# Altium schematic sheet USB_OTG_FS.SchDoc
size A4; DocumentNumber: 3; Revision: B.1(PCB.SCH); SheetNumber: 3; SheetTotal: 7
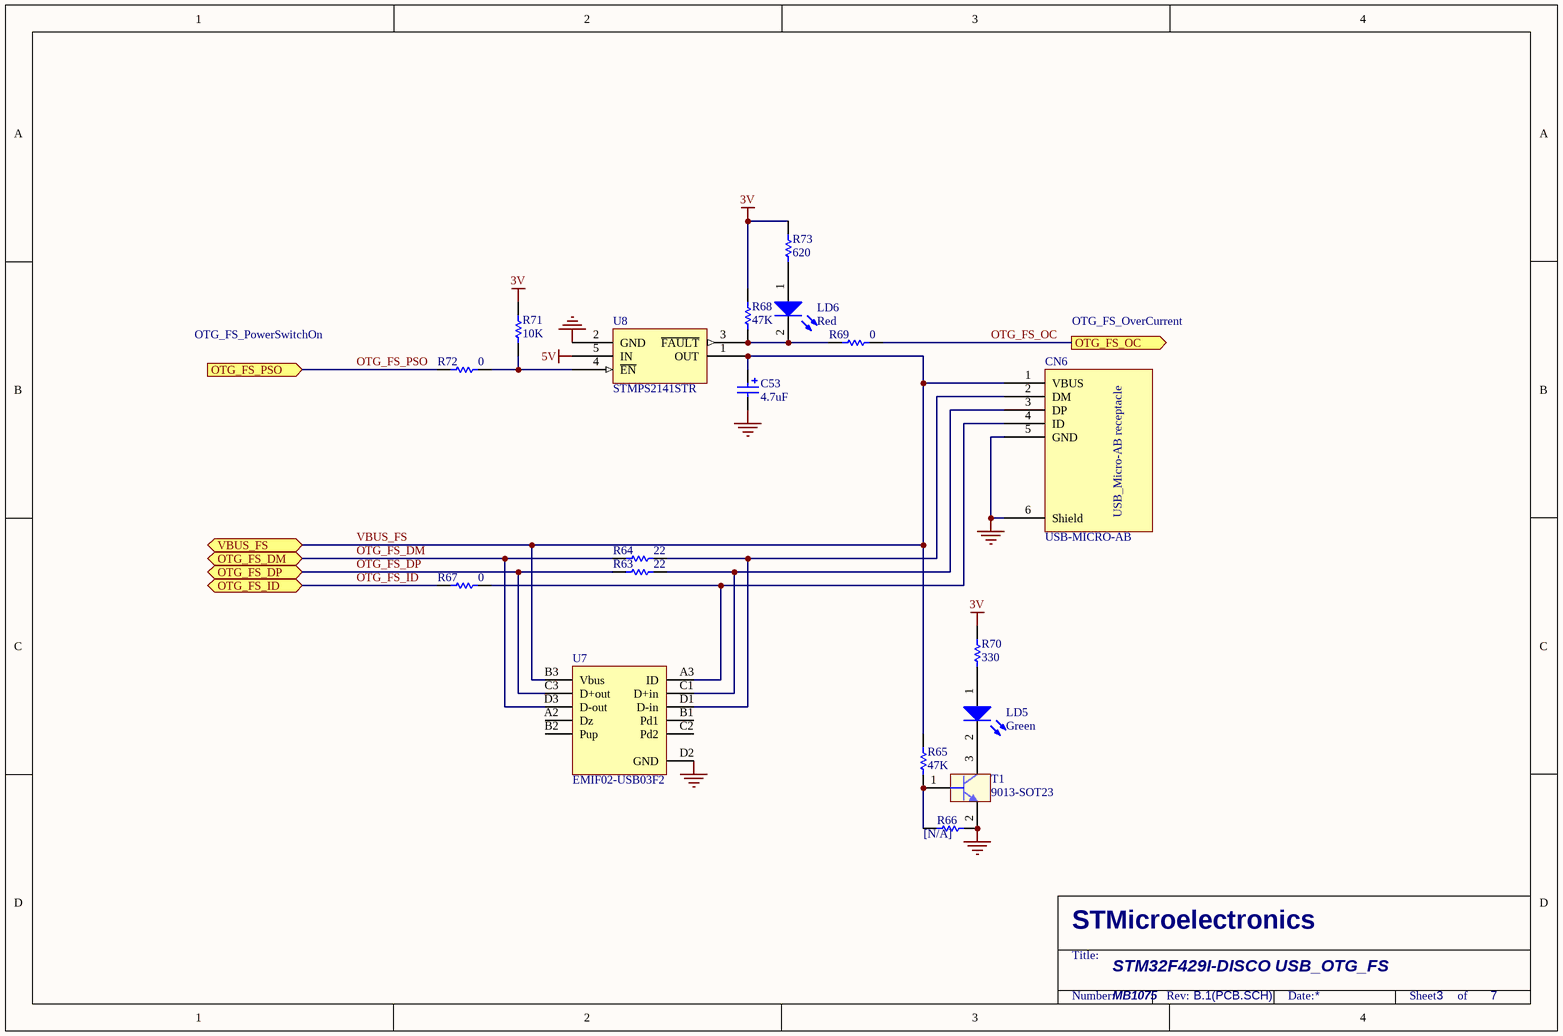
[diagram p0: USB_OTG_FS.SchDoc]

## Parts
C53  4.7uF  [TAN-A]
CN6  USB-MICRO-AB  [USB-MICRO-AB]
LD5  Green  [0603D]
LD6  Red  [0603D]
R63  22  [0402R]
R64  22  [0402R]
R65  47K  [0402R]
R66  [N/A]  [0402R]
R67  0  [0402R]
R68  47K  [0402R]
R69  0  [0402R]
R70  330  [0603R]
R71  10K  [0402R]
R72  0  [0402R]
R73  620  [0603R]
T1  9013-SOT23  [SOT-23]
U7  EMIF02-USB03F2  [Flip Chip]
U8  STMPS2141STR  [SOT23-5L]

## Ports
OTG_FS_DM, OTG_FS_DP, OTG_FS_ID, OTG_FS_OC, OTG_FS_PSO, VBUS_FS

## Nets
3V: R68.2 R70.2 R71.2 R73.2
5V: U8.5(IN)
GND: C53.2 CN6.5(GND) CN6.6(Shield) R66.2 T1.2(E) U7.D2(GND) U8.2(GND)
OTG_FS_DM: R64.1 U7.D3(D-out) ; port OTG_FS_DM
OTG_FS_DP: R63.1 U7.C3(D+out) ; port OTG_FS_DP
OTG_FS_ID: R67.1 ; port OTG_FS_ID
OTG_FS_OC: R69.2 ; port OTG_FS_OC
OTG_FS_PSO: R72.1 ; port OTG_FS_PSO
VBUS_FS: C53.1 CN6.1(VBUS) R65.2 U7.B3(Vbus) U8.1(OUT) ; port VBUS_FS
NetCN6_2: CN6.2(DM) R64.2 U7.D1(D-in)
NetCN6_3: CN6.3(DP) R63.2 U7.C1(D+in)
NetCN6_4: CN6.4(ID) R67.2 U7.A3(ID)
NetLD5_1: LD5.1(A) R70.1
NetLD5_2: LD5.2(K) T1.3(C)
NetLD6_1: LD6.1(A) R73.1
NetLD6_2: LD6.2(K) R68.1 R69.1 U8.3(~{FAULT})
NetR65_1: R65.1 R66.1 T1.1(B)
NetR71_1: R71.1 R72.2 U8.4(~{EN})

Not connected (* = marked no-connect by the designer): U7 A2(Dz) B1(Pd1) B2(Pup) C2(Pd2)

## Notes on the sheet
- OTG_FS_PowerSwitchOn
- OTG_FS_OverCurrent
- STM32F429I-DISCO USB_OTG_FS
- MB1075
- STMicroelectronics
- Title:
- Number:
- Rev:
- Date:
- Sheet       of
- (in symbol USB-MICRO-AB) USB_Micro-AB receptacle

## Library data of the parts
C53 = Cap Pol1: Polarized Capacitor (Radial); Value: 47uF; Published: 8-Jun-2000; Revision: July-2002: Re-released for DXP Platform.; Publisher: Altium Limited
CN6 = USB-MICRO-AB: USB-MICRO-AB, 47590-0001, SMT, MOLEX; Ref St: xxxxxxx; Manuf_1: MOLEX; Manuf_Part_1: 47590-0001; ECCN_US/EU: *; Distrib: *
LD5 LD6 = LED2: Typical RED, GREEN, YELLOW, AMBER GaAs LED; Published: 8-Jun-2000; Revision: July-2002: Re-released for DXP Platform.; Publisher: Altium Limited
R63-R65 R67-R70 R72 R73 = Resistor_ST: Resistor 0402 / 0603 / 0805; Description: Resistor 0402 or 0603 or 0805; Value: 10K
R66 = Resistor_ST: Resistor 0402 / 0603 / 0805; Description: Resistor 0402 or 0603 or 0805; Value: 10K; Fitted: NO
R71 = Resistor_ST: Resistor 0402 / 0603 / 0805; Description: Resistor 0402 or 0603 or 0805; Value: 10K
T1 = 9013-SOT23: NPN Bipolar Transistor; Description: NPN Bipolar Transistor, SOT-23 Footprint; Revision: July-2002: Re-released for DXP Platform.
U7 = EMIF02-USB03F2: 2-line IPAD, EMI filter including ESD protection; Manuf_1: STM; Provided: ST; ECCN_US/EU: EAR99/NEC; Ref St: 9179037; Order: EMIF02-USB03F2; Manuf_Part_1: EMIF02-USB03F2; Distrib: ST
U8 = STMPS2141STR: Enhanced single channel power switches; Manuf_1: STM; Provided: ST; ECCN_US/EU: EAR99/NEC; Order: STMPS2141STR; Manuf_Part_1: STMPS2141STR; Distrib: ST